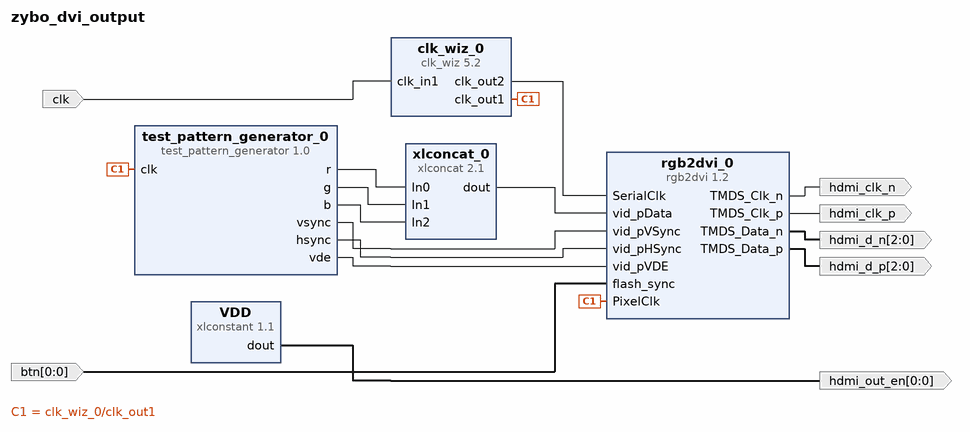
[diagram p0: block diagram of the top level]
# Vivado block design zybo_dvi_output, Vivado 2015.4
create_bd_design zybo_dvi_output

create_bd_port -dir O hdmi_clk_p
create_bd_port -dir O hdmi_clk_n
create_bd_port -dir O -from 2 -to 0 hdmi_d_p
create_bd_port -dir O -from 2 -to 0 hdmi_d_n
create_bd_port -dir I -type clk clk
set_property -dict {CONFIG.FREQ_HZ 125000000} [get_bd_ports clk]
create_bd_port -dir O -from 0 -to 0 hdmi_out_en
create_bd_port -dir I -from 0 -to 0 btn

create_bd_cell -type ip -vlnv xilinx.com:ip:clk_wiz:5.2 clk_wiz_0
set_property -dict [list \
  CONFIG.PRIMITIVE MMCM \
  CONFIG.CLKIN1_JITTER_PS 80.0 \
  CONFIG.CLKOUT2_USED true \
  CONFIG.NUM_OUT_CLKS 2 \
  CONFIG.CLKOUT1_REQUESTED_OUT_FREQ 60 \
  CONFIG.CLKOUT2_REQUESTED_OUT_FREQ 300 \
  CONFIG.CLKOUT1_DRIVES BUFG \
  CONFIG.CLKOUT2_DRIVES BUFG \
  CONFIG.CLKOUT3_DRIVES BUFG \
  CONFIG.CLKOUT4_DRIVES BUFG \
  CONFIG.CLKOUT5_DRIVES BUFG \
  CONFIG.CLKOUT6_DRIVES BUFG \
  CONFIG.CLKOUT7_DRIVES BUFG \
  CONFIG.FEEDBACK_SOURCE FDBK_AUTO \
  CONFIG.MMCM_DIVCLK_DIVIDE 5 \
  CONFIG.MMCM_CLKFBOUT_MULT_F 36.000 \
  CONFIG.MMCM_CLKIN1_PERIOD 8.0 \
  CONFIG.MMCM_COMPENSATION ZHOLD \
  CONFIG.MMCM_CLKOUT0_DIVIDE_F 15.000 \
  CONFIG.MMCM_CLKOUT1_DIVIDE 3 \
  CONFIG.CLKOUT1_JITTER 261.690 \
  CONFIG.CLKOUT1_PHASE_ERROR 249.865 \
  CONFIG.CLKOUT2_JITTER 198.991 \
  CONFIG.CLKOUT2_PHASE_ERROR 249.865 \
] [get_bd_cells clk_wiz_0]
create_bd_cell -type ip -vlnv xilinx.com:ip:xlconcat:2.1 xlconcat_0
set_property -dict {CONFIG.NUM_PORTS 3} [get_bd_cells xlconcat_0]
create_bd_cell -type ip -vlnv digilentinc.com:ip:rgb2dvi:1.2 rgb2dvi_0
set_property -dict {CONFIG.kGenerateSerialClk false CONFIG.kClkRange 1} [get_bd_cells rgb2dvi_0]
create_bd_cell -type ip -vlnv xilinx.com:ip:xlconstant:1.1 VDD
create_bd_cell -type ip -vlnv user.org:user:test_pattern_generator:1.0 test_pattern_generator_0
set_property -dict [list \
  CONFIG.DISPLAY_WIDTH 640 \
  CONFIG.H_FRONT_PORCH 110 \
  CONFIG.H_SYNC_PULSE 40 \
  CONFIG.H_BACK_PORCH 220 \
  CONFIG.DISPLAY_HEIGHT 480 \
  CONFIG.V_FRONT_PORCH 5 \
  CONFIG.V_SYNC_PULSE 5 \
  CONFIG.V_BACK_PORCH 20 \
] [get_bd_cells test_pattern_generator_0]

# ---- connections ----

connect_bd_net [get_bd_pins rgb2dvi_0/TMDS_Clk_p] [get_bd_ports hdmi_clk_p]
connect_bd_net [get_bd_pins rgb2dvi_0/TMDS_Clk_n] [get_bd_ports hdmi_clk_n]
connect_bd_net [get_bd_pins rgb2dvi_0/TMDS_Data_p] [get_bd_ports hdmi_d_p]
connect_bd_net [get_bd_pins rgb2dvi_0/TMDS_Data_n] [get_bd_ports hdmi_d_n]
connect_bd_net [get_bd_pins clk_wiz_0/clk_out1] [get_bd_pins rgb2dvi_0/PixelClk] [get_bd_pins test_pattern_generator_0/clk]
connect_bd_net [get_bd_ports clk] [get_bd_pins clk_wiz_0/clk_in1]
connect_bd_net [get_bd_pins clk_wiz_0/clk_out2] [get_bd_pins rgb2dvi_0/SerialClk]
connect_bd_net [get_bd_pins test_pattern_generator_0/r] [get_bd_pins xlconcat_0/In0]
connect_bd_net [get_bd_pins test_pattern_generator_0/g] [get_bd_pins xlconcat_0/In1]
connect_bd_net [get_bd_pins test_pattern_generator_0/b] [get_bd_pins xlconcat_0/In2]
connect_bd_net [get_bd_pins xlconcat_0/dout] [get_bd_pins rgb2dvi_0/vid_pData]
connect_bd_net [get_bd_pins test_pattern_generator_0/vsync] [get_bd_pins rgb2dvi_0/vid_pVSync]
connect_bd_net [get_bd_pins test_pattern_generator_0/hsync] [get_bd_pins rgb2dvi_0/vid_pHSync]
connect_bd_net [get_bd_pins test_pattern_generator_0/vde] [get_bd_pins rgb2dvi_0/vid_pVDE]
connect_bd_net [get_bd_pins VDD/dout] [get_bd_ports hdmi_out_en]
connect_bd_net [get_bd_ports btn] [get_bd_pins rgb2dvi_0/flash_sync]

validate_bd_design
save_bd_design
